# Altium schematic sheet SH4 - DIFFERENTIAL I2C.SchDoc: Safety - Differential I2C
size Letter; DrawnBy: Ayesha Ebrahim; Organization: UW Robotics; Address1: 200 University Avenue; Address2: Waterloo; Address3: Ontario; Address4: Canada N2L 3G6
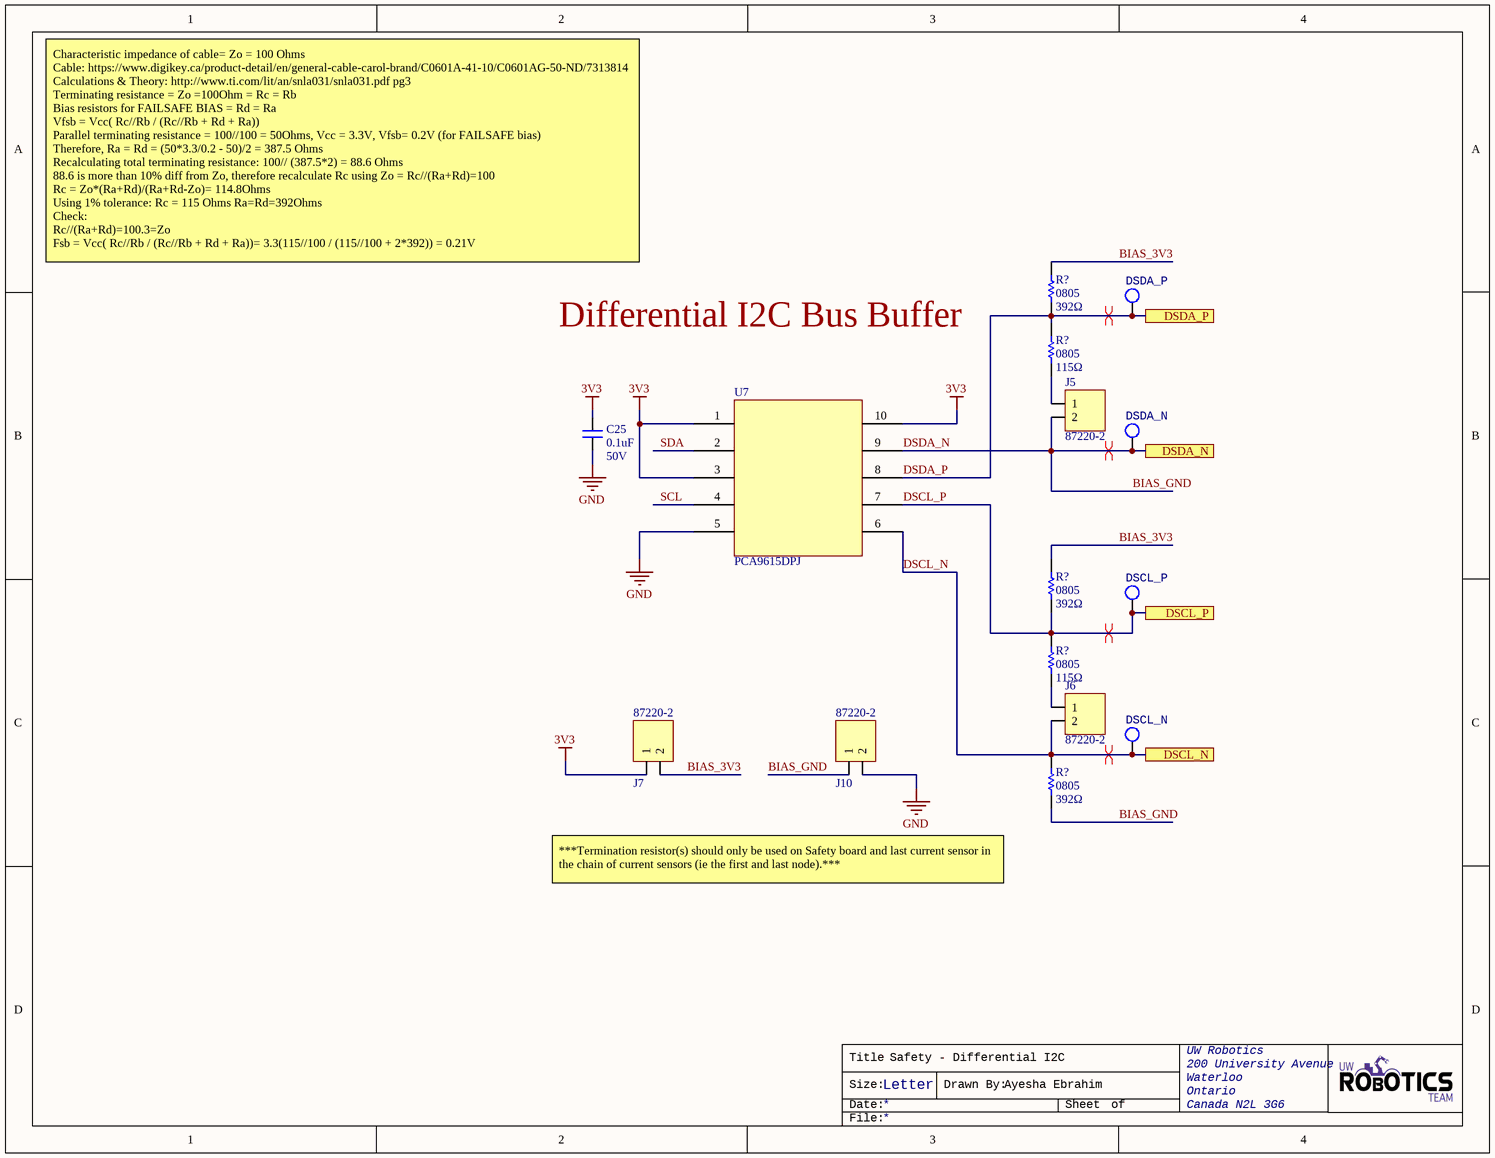
[diagram p0: SH4 - DIFFERENTIAL I2C.SchDoc]

## Parts
(Parts that share a designator on the sheet are numbered #1, #2 ... from top to bottom, then left to right.)
C25  value 0.1uF  Voltage Rating: 50V  [CAPC2012X140N]  (hidden comment: CAP_0.1uF_50V_0805)
J5  Manufacturer Part Number 1: 87220-2  [HDR1X2]  (hidden comment: JUMPER_2)
J6  Manufacturer Part Number 1: 87220-2  [HDR1X2]  (hidden comment: JUMPER_2)
J7  Manufacturer Part Number 1: 87220-2  [HDR1X2]  (hidden comment: JUMPER_2)
J10  Manufacturer Part Number 1: 87220-2  [HDR1X2]  (hidden comment: JUMPER_2)
R?#1  Case Code (Imperial): 0805  Resistance: 392Ω  [RESC2012X60N]  (hidden comment: RES_392Ω_0805)
R?#2  Case Code (Imperial): 0805  Resistance: 115Ω  [RESC2012X60N]  (hidden comment: RES_115Ω_0805)
R?#3  Case Code (Imperial): 0805  Resistance: 392Ω  [RESC2012X60N]  (hidden comment: RES_392Ω_0805)
R?#4  Case Code (Imperial): 0805  Resistance: 115Ω  [RESC2012X60N]  (hidden comment: RES_115Ω_0805)
R?#5  Case Code (Imperial): 0805  Resistance: 392Ω  [RESC2012X60N]  (hidden comment: RES_392Ω_0805)
TP1  DSDA_P  [TESTPOINT_LOOP]
TP2  DSDA_N  [TESTPOINT_LOOP]
TP3  DSCL_P  [TESTPOINT_LOOP]
TP4  DSCL_N  [TESTPOINT_LOOP]
U7  DIFF_I2C_BUFFER  [PCA9615DPJ]  (value not drawn)

## Ports
DSCL_N, DSCL_P, DSDA_N, DSDA_P

## Nets
3V3: C25.2 J7.1 U7.1(VDDA) U7.3(EN) U7.10(VDDB)
GND: C25.1 J10.2 U7.5(VSS)
BIAS_3V3: J7.2 R?#1.2 R?#3.2
BIAS_GND: J5.2 J10.1 R?#5.1 TP2.1 U7.9(DSDAM) ; port DSDA_N  [also labelled DSDA_N]
DSCL_N: J6.2 R?#5.2 TP4.1 U7.6(DSCLM) ; port DSCL_N
DSCL_P: R?#3.1 R?#4.2 TP3.1 U7.7(DSCLP) ; port DSCL_P
DSDA_P: R?#1.1 R?#2.2 TP1.1 U7.8(DSDAP) ; port DSDA_P
SCL: U7.4(SCL)
SDA: U7.2(SDA)
NetJ5_1: J5.1 R?#2.1
NetJ6_1: J6.1 R?#4.1

## Layout directives
differential pair: BIAS_GND, DSCL_N, DSCL_P, DSDA_P

## Notes on the sheet
- Characteristic impedance of cable= Zo = 100 Ohms
  Cable: https://www.digikey.ca/product-detail/en/general-cable-carol-brand/C0601A-41-10/C0601AG-50-ND/7313814
  Calculations & Theory: http://www.ti.com/lit/an/snla031/snla031.pdf pg3
  Terminating resistance = Zo =100Ohm = Rc = Rb
  Bias resistors for FAILSAFE BIAS = Rd = Ra
  Vfsb = Vcc( Rc//Rb / (Rc//Rb + Rd + Ra))
  Parallel terminating resistance = 100//100 = 50Ohms, Vcc = 3.3V, Vfsb= 0.2V (for FAILSAFE bias)
  Therefore, Ra = Rd = (50*3.3/0.2 - 50)/2 = 387.5 Ohms
  Recalculating total terminating resistance: 100// (387.5*2) = 88.6 Ohms
  88.6 is more than 10% diff from Zo, therefore recalculate Rc using Zo = Rc//(Ra+Rd)=100
  Rc = Zo*(Ra+Rd)/(Ra+Rd-Zo)= 114.8Ohms
  Using 1% tolerance: Rc = 115 Ohms Ra=Rd=392Ohms
  Check:
  Rc//(Ra+Rd)=100.3=Zo
  Fsb = Vcc( Rc//Rb / (Rc//Rb + Rd + Ra))= 3.3(115//100 / (115//100 + 2*392)) = 0.21V
- (near R?#1) Differential I2C Bus Buffer
- ***Termination resistor(s) should only be used on Safety board and last current sensor in the chain of current sensors (ie the first and last node).***
- Title
- Size:
- Date:
- Letter
- Drawn By:
- Sheet
- of
- File:

## Library data of the parts
C25 = CAP_0.1uF_50V_0805: CAP CER 0.1UF 50V X7R 0805; Manufacturer 1: Murata; Manufacturer Part Number 1: GCD21BR71H104KA01L; Capacitance: 100nF; Tolerance: 10%; Supplier 1: Digi-Key; Mount: Surface Mount; Case/Package: 0805; Case Code (Metric): 2012; Case Code (Imperial): 0805; Min Operating Temperature: -55°C; Max Operating Temperature: 125°C; Dielectric: X7R; Termination: SMD/SMT; Length: 2mm; Height: 1.25mm; Width: 0.049inch; Thickness: 0.049inch; Depth: 1.25mm; Ratings: AEC-Q200; ComponentLink1URL: https://datasheet.ciiva.com/29537/c03e-29537701.pdf?src-supplier=Digi-Key; ComponentLink1Description: https://datasheet.ciiva.com/29537/c03e-29537701.pdf?src-supplier=Digi-Key; Supplier Part Number 1: 490-11955-1-ND
J5-J7 J10 = JUMPER_2: HEADER 2X1; Manufacturer 1: TE Connectivity; Supplier 1: Digi-Key; Supplier Part Number 1: A26542-ND; Mount: Through Hole
R?#1 R?#3 R?#5 = RES_392Ω_0805: RES SMD 392 OHM 1% 1/8W 0805; Manufacturer 1: Yageo; Manufacturer Part Number 1: RC0805FR-07392RL; Max Power Dissipation: 125mW; Temperature Coefficient: 100ppm/°C; Voltage Rating (DC): 150V; Case Code (Metric): 2012; Category: Chip SMD Resistors; Composition: Thick Film; Depth: 1.25mm; Features: Moisture Resistant; Height: 0.024inch; Military Standard: Not; Max Operating Temperature: 155°C; Manufacturer Part Number: RC0805FR-07392RL; Length: 0.079inch; Min Operating Temperature: -55°C; Number of Terminations: 2; Power Rating: 125mW; Tolerance: 1%; Width: 0.049inch; Supplier 1: Digi-Key; Supplier Part Number 1: 311-392CRCT-ND; Supplier Packaging 1: Cut Tape; Supplier Unit Price 1: 0.15 CAD; Supplier Location 1: US; Package: 0805 (2012 Metric)
R?#2 R?#4 = RES_115Ω_0805: RES SMD 115 OHM 1% 1/8W 0805; Manufacturer 1: Yageo; Manufacturer Part Number 1: RC0805FR-07115RL; Max Power Dissipation: 125mW; Temperature Coefficient: 100ppm/°C; Voltage Rating (DC): 150V; Case Code (Metric): 2012; Category: Chip SMD Resistors; Composition: Thick Film; Depth: 1.25mm; Features: Moisture Resistant; Height: 0.024inch; Military Standard: Not; Max Operating Temperature: 155°C; Manufacturer Part Number: RC0805FR-07115RL; Length: 0.079inch; Min Operating Temperature: -55°C; Number of Terminations: 2; Power Rating: 125mW; Tolerance: 1%; Width: 0.049inch; Supplier 1: Digi-Key; Supplier Part Number 1: 311-115CRCT-ND; Supplier Packaging 1: Cut Tape; Supplier Unit Price 1: 0.14476 CAD; Supplier Location 1: US; Package: 0805 (2012 Metric)
TP1-TP4 = TESTPOINT_LOOP: Loop testpoint through-hole pad; Manufacturer 1: Keystone Electronics; Manufacturer Part Number 1: 5002; Supplier Part Number 1: 36-5002-ND; Supplier 1: Digi-Key; Mount: Through Hole
U7 = DIFF_I2C_BUFFER: IC DIFF I2C BUFFER 2CH 10TSSOP; Manufacturer 1: NXP Semiconductors; Number of Channels: 2; Operating Supply Current: 16uA; Input: 2-Wire Bus; Max Frequency: 1MHz; Supplier 1: Digi-Key; Stock 1: 4899; Pricing 1: 1=2.95000, 10=2.64900, 100=2.05930, 500=1.78100, 1000=1.48045 (USD); RoHS: Yes; Case/Package: 10-TSSOP; Number of Pins: 10; Min Operating Temperature: -40°C; Max Operating Temperature: 85°C; Packaging: Cut Tape; Package Quantity: 1; ComponentLink1URL: http://www.farnell.com/datasheets/2340284.pdf?src-supplier=Farnell; ComponentLink1Description: http://www.farnell.com/datasheets/2340284.pdf?src-supplier=Farnell; ComponentLink2URL: http://www.mouser.com/ds/2/302/PCA9615-841773.pdf?src-supplier=Mouser; ComponentLink2Description: http://www.mouser.com/ds/2/302/PCA9615-841773.pdf?src-supplier=Mouser; ComponentLink3URL: http://components.arrow.com/part/dataview/65281105S797392N7788?src-supplier=Arrow; ComponentLink3Description: http://components.arrow.com/part/dataview/65281105S797392N7788?src-supplier=Arrow; ComponentLink4URL: http://www.nxp.com/documents/data_sheet/PCA9615.pdf?src-supplier=Avnet; ComponentLink4Description: http://www.nxp.com/documents/data_sheet/PCA9615.pdf?src-supplier=Avnet; ComponentLink5Description: Digikey Link; ComponentLink5URL: https://www.digikey.ca/products/en/integrated-circuits-ics/interface-signal-buffers-repeaters-splitters/756?k=PCA9615&k=&pkeyword=PCA9615&sv=0&pv7=2&sf=0&FV=-8%7C756&quantity=&ColumnSort=0&page=1&pageSize=25; Supplier Part Number 1: 568-11484-1-ND; Mount: Surface Mount; Manufacturer Part Number 1: PCA9615DPJ